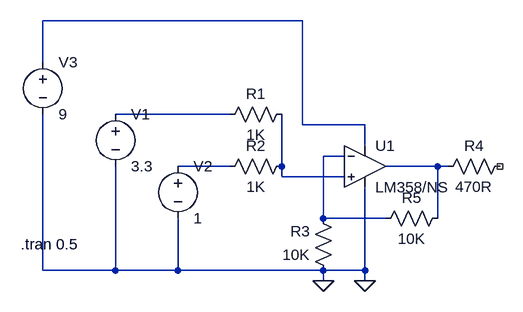
[diagram p0: schematic LM358_adder.asc]
LM358_adder.asc, the LTspice schematic file:
Version 4
SHEET 1 880 680
WIRE 112 -48 -288 -48
WIRE -288 16 -288 -48
WIRE 0 96 -176 96
WIRE 112 112 112 -48
WIRE 208 112 112 112
WIRE 208 144 208 112
WIRE 176 160 144 160
WIRE 0 176 -80 176
WIRE 80 176 80 96
WIRE 320 176 240 176
WIRE 336 176 320 176
WIRE 80 192 80 176
WIRE 176 192 80 192
WIRE 144 256 144 160
WIRE 240 256 144 256
WIRE 320 256 320 176
WIRE -288 336 -288 96
WIRE -176 336 -176 176
WIRE -176 336 -288 336
WIRE -80 336 -80 256
WIRE -80 336 -176 336
WIRE 144 336 -80 336
WIRE 208 336 208 208
WIRE 208 336 144 336
WIRE 144 352 144 336
WIRE 208 352 208 336
FLAG 144 352 0
FLAG 208 352 0
SYMBOL EXTRA\\ExtraOpamps\\LM358_NS 208 176 R0
SYMATTR InstName U1
SYMBOL res 96 80 R90
WINDOW 0 0 56 VBottom 2
WINDOW 3 32 56 VTop 2
SYMATTR InstName R1
SYMATTR Value 1K
SYMBOL res 96 160 R90
WINDOW 0 0 56 VBottom 2
WINDOW 3 32 56 VTop 2
SYMATTR InstName R2
SYMATTR Value 1K
SYMBOL res 160 352 R180
WINDOW 0 36 76 Left 2
WINDOW 3 36 40 Left 2
SYMATTR InstName R3
SYMATTR Value 10K
SYMBOL res 432 160 R90
WINDOW 0 0 56 VBottom 2
WINDOW 3 32 56 VTop 2
SYMATTR InstName R4
SYMATTR Value 470R
SYMBOL voltage -176 80 R0
WINDOW 123 0 0 Left 0
WINDOW 39 0 0 Left 0
SYMATTR InstName V1
SYMATTR Value 3.3
SYMBOL voltage -80 160 R0
WINDOW 123 0 0 Left 0
WINDOW 39 0 0 Left 0
SYMATTR InstName V2
SYMATTR Value 1
SYMBOL voltage -288 0 R0
WINDOW 123 0 0 Left 0
WINDOW 39 0 0 Left 0
SYMATTR InstName V3
SYMATTR Value 9
SYMBOL res 336 240 R90
WINDOW 0 0 56 VBottom 2
WINDOW 3 32 56 VTop 2
SYMATTR InstName R5
SYMATTR Value 10K
TEXT -322 296 Left 2 !.tran 0.5

The netlist it stands for:
* LM358_adder.asc
XU1 N005 N003 N001 0 N006 LM358/NS  ; pins In+ In- V+ V- OUT
R1 N005 N002 1K
R2 N005 N004 1K
R3 0 N003 10K
R4 NC_01 N006 470R
V1 N002 0 3.3
V2 N004 0 1
V3 N001 0 9
R5 N006 N003 10K
.tran 0.5
.backanno
.end